# Altium schematic sheet VOLTAGE_REGULATOR.SchDoc
size A; SheetNumber: 2; SheetTotal: 5
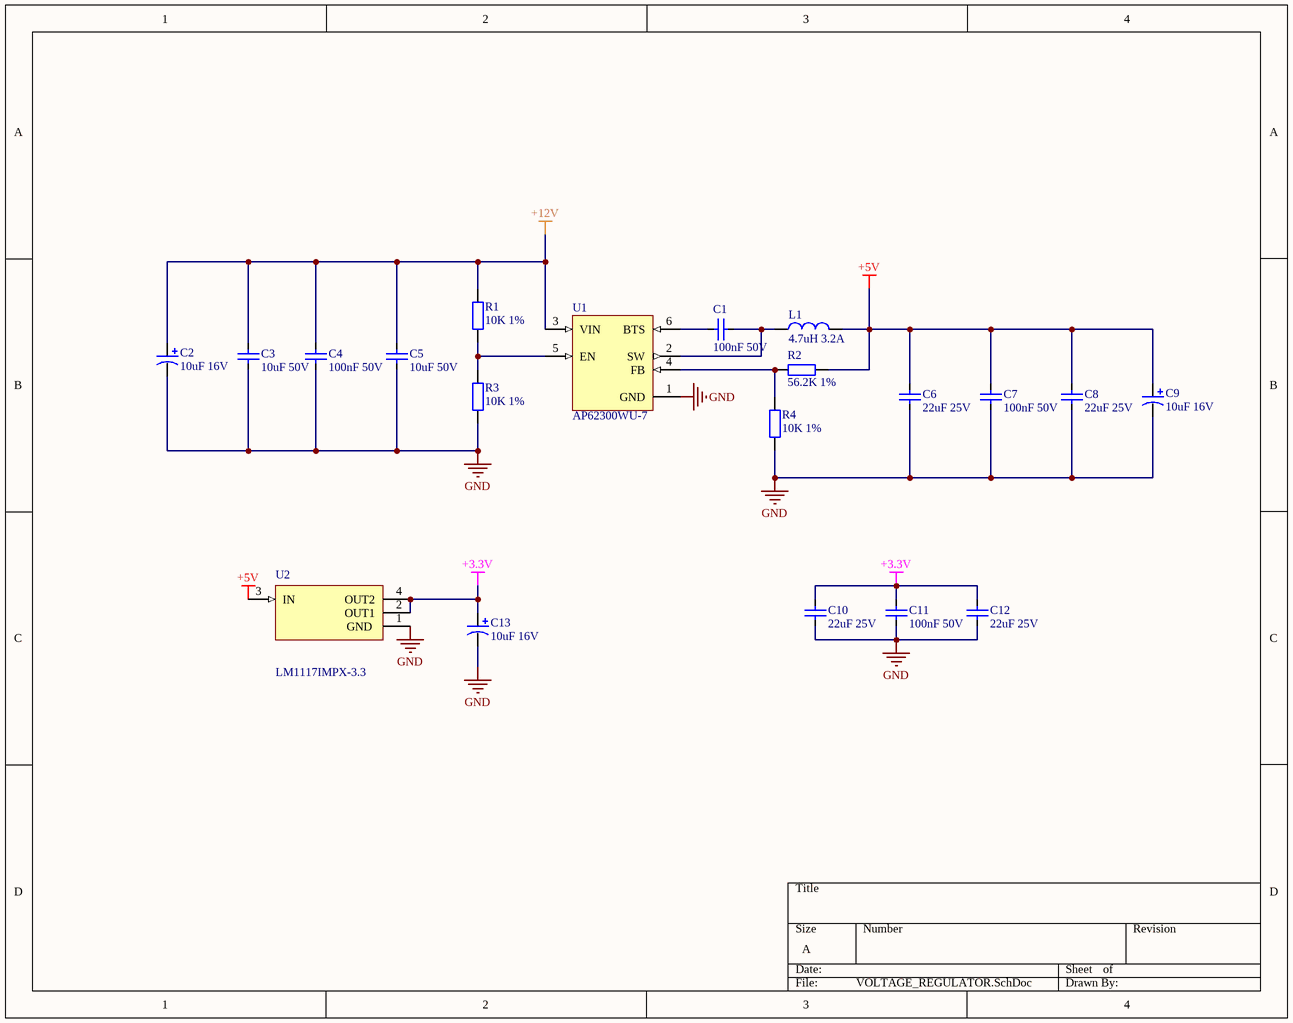
[diagram p0: VOLTAGE_REGULATOR.SchDoc]

## Parts
C1  100nF 50V  [CAP_SMD_0805]
C2  10uF 16V  [CAP-ALU-SMD-C]
C3  10uF 50V  [CAP_SMD_0805]
C4  100nF 50V  [CAP_SMD_0805]
C5  10uF 50V  [CAP_SMD_0805]
C6  22uF 25V  [CAP_SMD_0805]
C7  100nF 50V  [CAP_SMD_0805]
C8  22uF 25V  [CAP_SMD_0805]
C9  10uF 16V  [CAP-ALU-SMD-C]
C10  22uF 25V  [CAP_SMD_0805]
C11  100nF 50V  [CAP_SMD_0805]
C12  22uF 25V  [CAP_SMD_0805]
C13  10uF 16V  [CAP-ALU-SMD-C]
L1  4.7uH 3.2A  [L_5.5X5.2]
R1  10K 1%  [RES_SMD_0805]
R2  56.2K 1%  [RES_SMD_0805]
R3  10K 1%  [RES_SMD_0805]
R4  10K 1%  [RES_SMD_0805]
U1  AP62300WU-7  [SOT-23-6]
U2  LM1117IMPX-3.3  [SOT-223-4]

## Nets
+3.3V: C10.2 C11.2 C12.2 C13.1 U2.2(OUT1) U2.4(OUT2)
+5V: C6.2 C7.2 C8.2 C9.1 L1.2 R2.2 U2.3(IN)
+12V: C2.1 C3.2 C4.2 C5.2 R1.2 U1.3(VIN)
GND: C2.2 C3.1 C4.1 C5.1 C6.1 C7.1 C8.1 C9.2 C10.1 C11.1 C12.1 C13.2 R3.1 R4.1 U1.1(GND) U2.1(GND)
NetC1_1: C1.1 L1.1 U1.2(SW)
NetC1_2: C1.2 U1.6(BTS)
NetR1_1: R1.1 R3.2 U1.5(EN)
NetR2_1: R2.1 R4.2 U1.4(FB)

## Notes on the sheet
- (in symbol AP62300WU-7) /
- (in symbol LM1117IMPX-3.3/NOPB) /

## Library data of the parts
C1 C4 C7 C11 = C0805_MLCC_100nF_50V: 0.1 µF ±10% 50V Ceramic Capacitor X7R 0805 (2012 Metric); Manufacturer: YAGEO; Manufacture Part Number: CC0805KRX7R9BB104; Packaging: Cut Tape (CT); Link: https://www.digikey.cn/en/products/detail/yageo/CC0805KRX7R9BB104/302874; Price: $0.10
C2 C9 C13 = C_ALU_10uF_16V: 10 µF 16 V Aluminum - Polymer Capacitors Radial, Can - SMD 30mOhm 2000 Hrs @ 105°C; Manufacturer: Würth Elektronik; Manufacture Part Number: 875105359001; Packaging: Cut Tape (CT); Size code: C; Link: https://www.digikey.cn/en/products/detail/w%C3%BCrth-elektronik/875105359001/5147580; Price: $0.51
C3 C5 = C0805_MLCC_10uF_50V: 10 µF ±20% 50V Ceramic Capacitor X5R 0805 (2012 Metric); Manufacturer: Murata Electronics; Manufacture Part Number: GRM21BR61H106ME43L; Packaging: Cut Tape (CT); Link: https://www.digikey.cn/en/products/detail/murata-electronics/GRM21BR61H106ME43L/10326317; Price: $0.34
C6 C8 C10 C12 = C0805_MLCC_22uF_25V: 22 µF ±20% 25V Ceramic Capacitor X5R 0805 (2012 Metric); Manufacturer: Samsung Electro-Mechanics; Manufacture Part Number: CL21A226MAYNNNE; Packaging: Cut Tape (CT); Link: https://www.digikey.cn/en/products/detail/samsung-electro-mechanics/CL21A226MAYNNNE/10479857; Price: $0.25
L1 = L_SMD_4.7uH_3.2A: 4.7 µH Shielded Molded Inductor 3.2 A 81.3mOhm Max Nonstandard; Manufacturer: Vishay Dale; Manufacture Part Number: IHLP2020BZER4R7M11; Packaging: Cut Tape (CT); Link: https://www.digikey.com/en/products/detail/vishay-dale/IHLP2020BZER4R7M11/2025062; Price: $1.19
R1 R3 R4 = R0805_10K: 10 kOhms ±1% 0.125W, 1/8W Chip Resistor 0805 (2012 Metric) Moisture Resistant Thick Film; Manufacturer: YAGEO; Manufacture Part Number: RC0805FR-0710KL; Packaging: Cut Tape (CT); Price: $0.10; Link: https://www.digikey.cn/en/products/detail/yageo/RC0805FR-0710KL/727535
R2 = R0805_56.2K: 56.2 kOhms ±1% 0.125W, 1/8W Chip Resistor 0805 (2012 Metric) Moisture Resistant Thick Film; Manufacturer: YAGEO; Manufacture Part Number: RC0805FR-0756K2L; Packaging: Cut Tape (CT); Link: https://www.digikey.com/en/products/detail/yageo/RC0805FR-0756K2L/728035; Price: $0.10
U1 = AP62300WU-7: Buck Switching Regulator IC Positive Adjustable 0.8V 1 Output 3A SOT-23-6 Thin, TSOT-23-6; Manufacturer: Diodes Incorporated; Manufacture Part Number: AP62300WU-7; Packaging: Cut Tape (CT); Link: https://www.digikey.cn/en/products/detail/diodes-incorporated/AP62300WU-7/12324870?s=N4IgTCBcDaIIIAUBsYDMAGdB1AqiAugL5A; Price: $0.46
U2 = LM1117IMPX-3.3/NOPB: Linear Voltage Regulator IC Positive Fixed 1 Output 800mA SOT-223-4; Manufacturer: Texas Instruments; Manufacture Part Number: LM1117IMPX-3.3/NOPB; Packaging: Cut Tape (CT); Link: https://www.digikey.cn/en/products/detail/texas-instruments/LM1117IMPX-3-3-NOPB/1870906; Price: $1.14